# EasyEDA schematic SCH_555 Timer Based Keyboard_2023-12-17.json
TITLE: Sheet_1; REV: 1.0; Date: 2023-11-20; Sheet: 1/1; Drawn By: extras2765; Company: Your Company
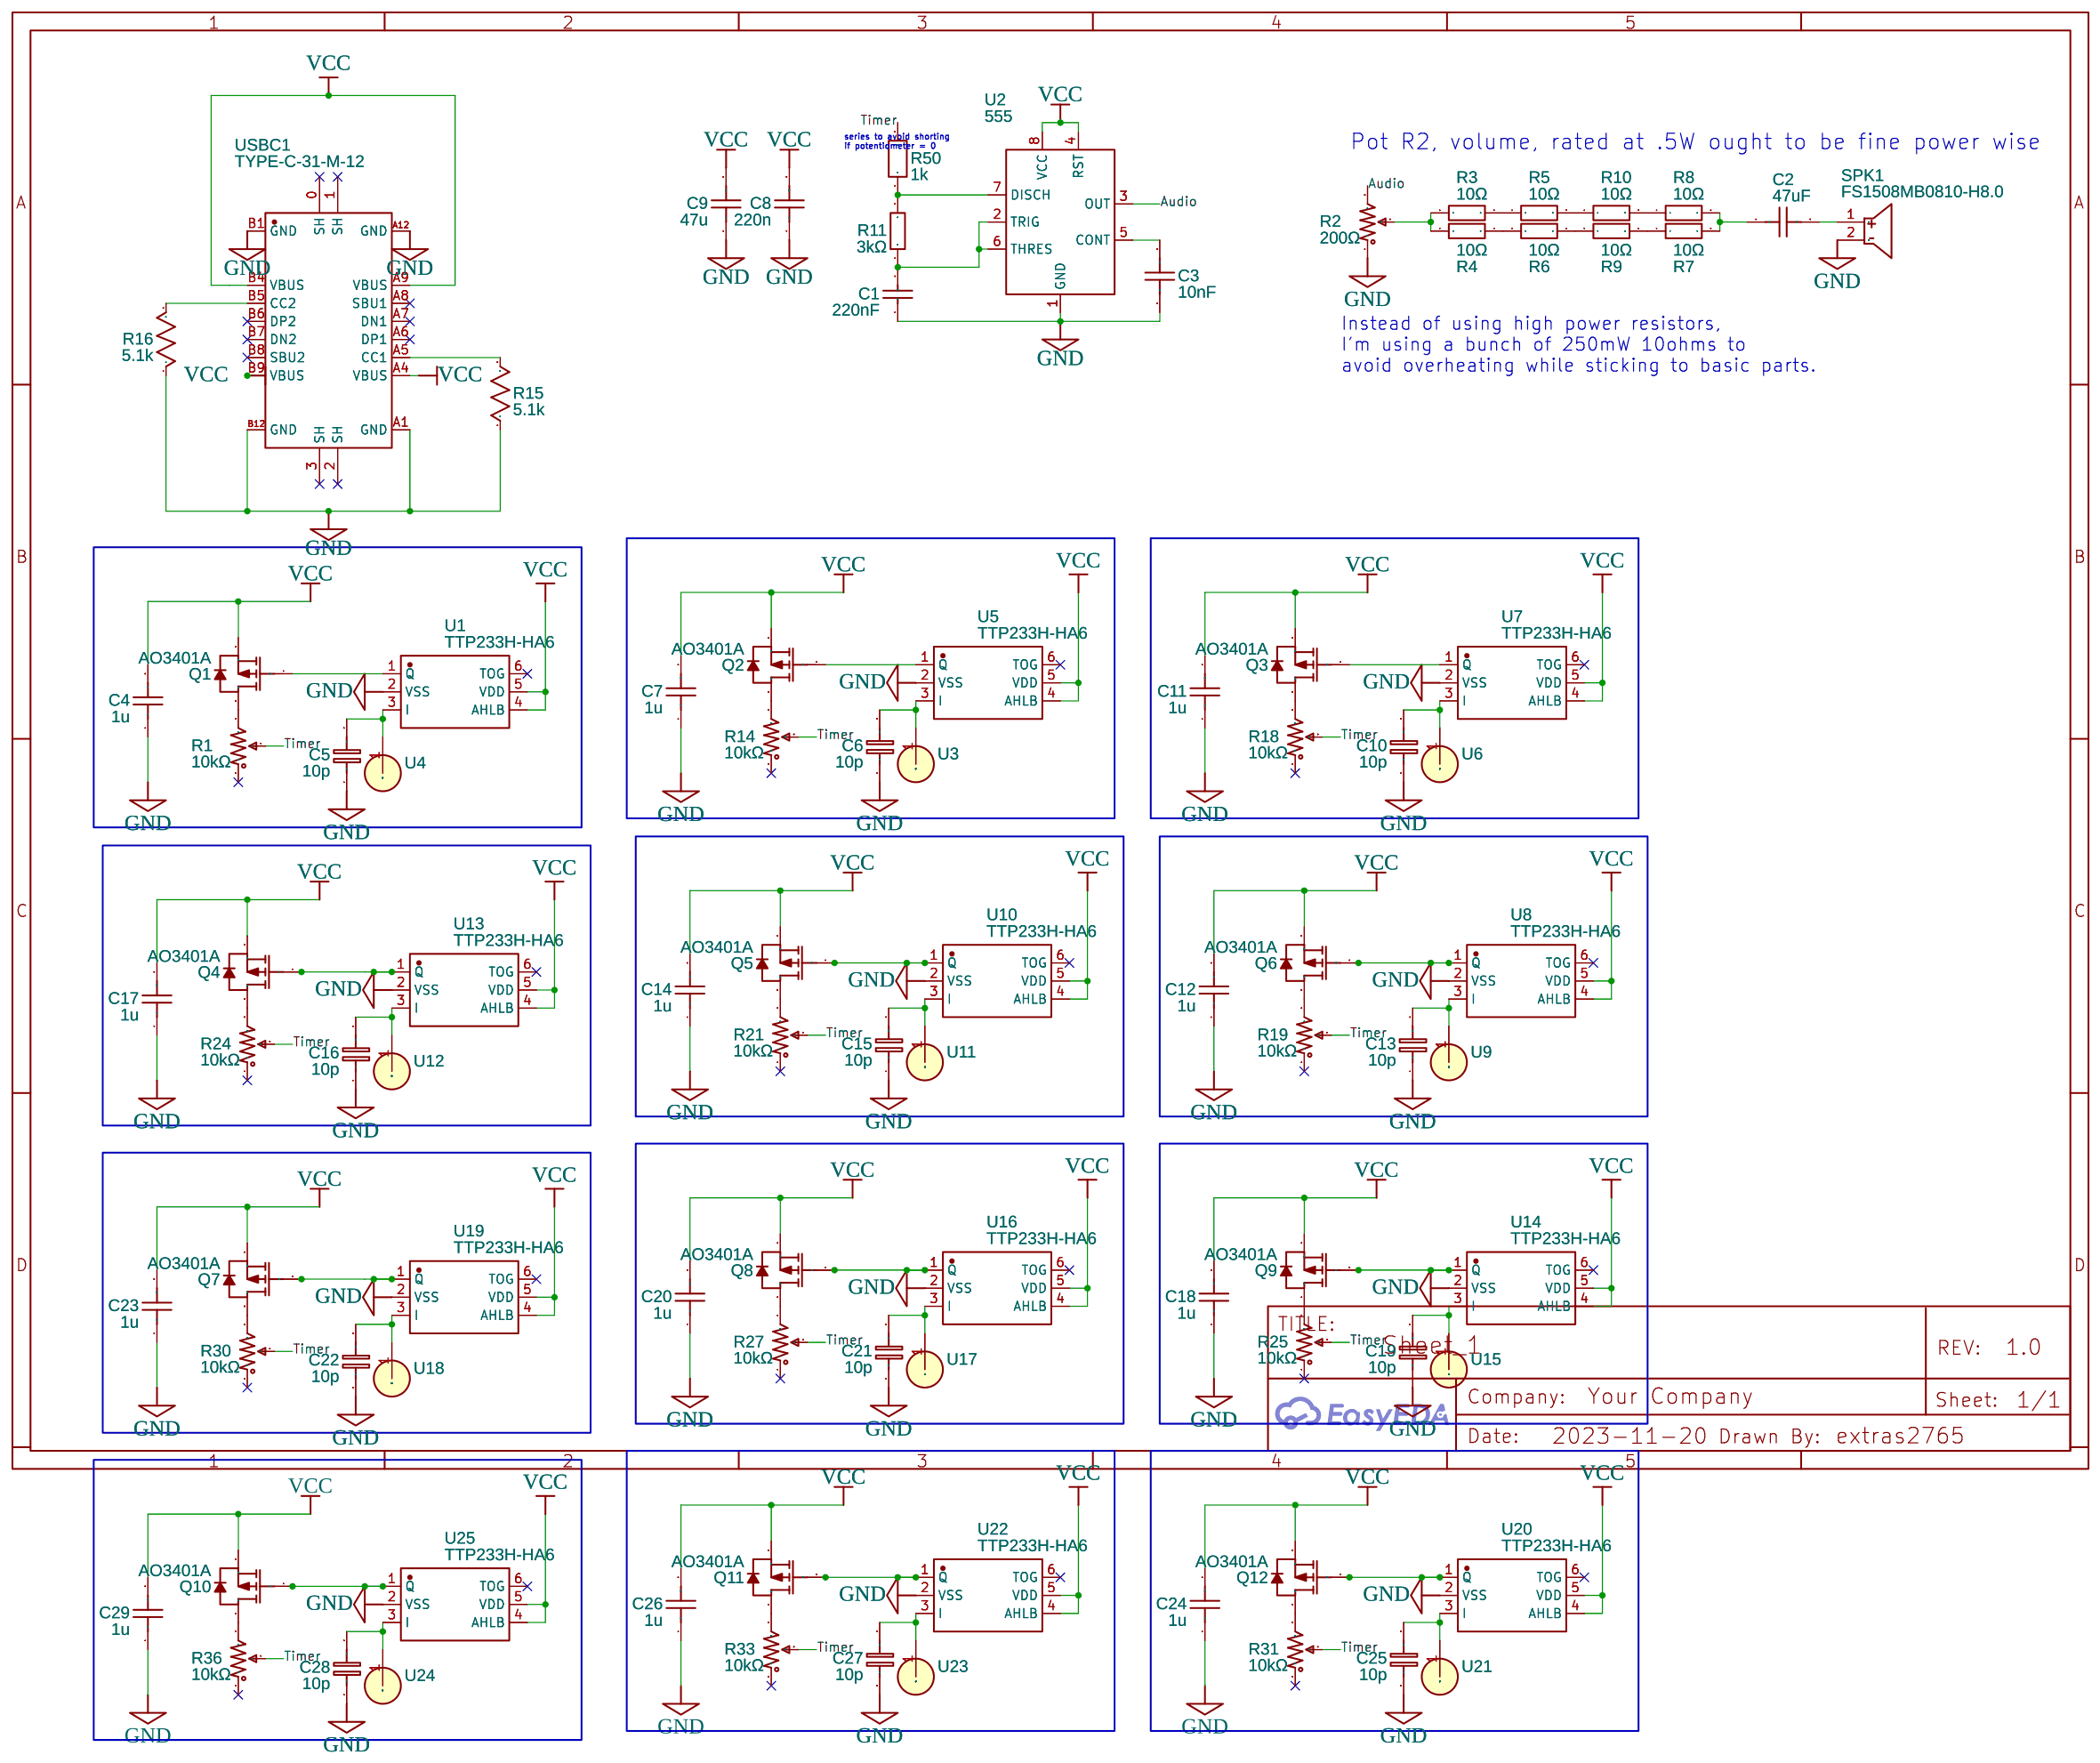
[diagram p0: schematic sheet]

## Parts
C1  220nF  [C0805]
C2  47uF  [C1206]
C3  10nF  [C0805]
C4  1u  [C0805]
C5  10p  [C0603]
C6  10p  [C0603]
C7  1u  [C0805]
C8  220n  [C0805]
C9  47u  [C0805]
C10  10p  [C0603]
C11  1u  [C0805]
C12  1u  [C0805]
C13  10p  [C0603]
C14  1u  [C0805]
C15  10p  [C0603]
C16  10p  [C0603]
C17  1u  [C0805]
C18  1u  [C0805]
C19  10p  [C0603]
C20  1u  [C0805]
C21  10p  [C0603]
C22  10p  [C0603]
C23  1u  [C0805]
C24  1u  [C0805]
C25  10p  [C0603]
C26  1u  [C0805]
C27  10p  [C0603]
C28  10p  [C0603]
C29  1u  [C0805]
Q1  AO3401A  [SOT-23_L2.9-W1.3-P1.90-LS2.4-BR]
Q2  AO3401A  [SOT-23_L2.9-W1.3-P1.90-LS2.4-BR]
Q3  AO3401A  [SOT-23_L2.9-W1.3-P1.90-LS2.4-BR]
Q4  AO3401A  [SOT-23_L2.9-W1.3-P1.90-LS2.4-BR]
Q5  AO3401A  [SOT-23_L2.9-W1.3-P1.90-LS2.4-BR]
Q6  AO3401A  [SOT-23_L2.9-W1.3-P1.90-LS2.4-BR]
Q7  AO3401A  [SOT-23_L2.9-W1.3-P1.90-LS2.4-BR]
Q8  AO3401A  [SOT-23_L2.9-W1.3-P1.90-LS2.4-BR]
Q9  AO3401A  [SOT-23_L2.9-W1.3-P1.90-LS2.4-BR]
Q10  AO3401A  [SOT-23_L2.9-W1.3-P1.90-LS2.4-BR]
Q11  AO3401A  [SOT-23_L2.9-W1.3-P1.90-LS2.4-BR]
Q12  AO3401A  [SOT-23_L2.9-W1.3-P1.90-LS2.4-BR]
R1  10kΩ  [RES-ADJ-TH_3P-L10.0-W10.0-P2.50-L]
R2  200Ω  [RES-ADJ-TH_3P-L9.5-W9.5-P2.54-BR-BS]
R3  10Ω  [R1206]
R4  10Ω  [R1206]
R5  10Ω  [R1206]
R6  10Ω  [R1206]
R7  10Ω  [R1206]
R8  10Ω  [R1206]
R9  10Ω  [R1206]
R10  10Ω  [R1206]
R11  3kΩ  [R0805]
R14  10kΩ  [RES-ADJ-TH_3P-L10.0-W10.0-P2.50-L]
R15  5.1k  [R0805]
R16  5.1k  [R0805]
R18  10kΩ  [RES-ADJ-TH_3P-L10.0-W10.0-P2.50-L]
R19  10kΩ  [RES-ADJ-TH_3P-L10.0-W10.0-P2.50-L]
R21  10kΩ  [RES-ADJ-TH_3P-L10.0-W10.0-P2.50-L]
R24  10kΩ  [RES-ADJ-TH_3P-L10.0-W10.0-P2.50-L]
R25  10kΩ  [RES-ADJ-TH_3P-L10.0-W10.0-P2.50-L]
R27  10kΩ  [RES-ADJ-TH_3P-L10.0-W10.0-P2.50-L]
R30  10kΩ  [RES-ADJ-TH_3P-L10.0-W10.0-P2.50-L]
R31  10kΩ  [RES-ADJ-TH_3P-L10.0-W10.0-P2.50-L]
R33  10kΩ  [RES-ADJ-TH_3P-L10.0-W10.0-P2.50-L]
R36  10kΩ  [RES-ADJ-TH_3P-L10.0-W10.0-P2.50-L]
R50  1k  [R0805]
SPK1  FS1508MB0810-H8.0  [BEEP-TH_BD15.0-P10.20-D1.2]
U1  TTP233H-HA6  [SOT-23-6_L2.9-W1.6-P0.95-LS2.8-BL]
U2  555  [SOIC-8_L4.9-W3.9-P1.27-LS6.0-BL]
U3  TouchPad  [TOUCHPAD]
U4  TouchPad  [TOUCHPAD]
U5  TTP233H-HA6  [SOT-23-6_L2.9-W1.6-P0.95-LS2.8-BL]
U6  TouchPad  [TOUCHPAD]
U7  TTP233H-HA6  [SOT-23-6_L2.9-W1.6-P0.95-LS2.8-BL]
U8  TTP233H-HA6  [SOT-23-6_L2.9-W1.6-P0.95-LS2.8-BL]
U9  TouchPad  [TOUCHPAD]
U10  TTP233H-HA6  [SOT-23-6_L2.9-W1.6-P0.95-LS2.8-BL]
U11  TouchPad  [TOUCHPAD]
U12  TouchPad  [TOUCHPAD]
U13  TTP233H-HA6  [SOT-23-6_L2.9-W1.6-P0.95-LS2.8-BL]
U14  TTP233H-HA6  [SOT-23-6_L2.9-W1.6-P0.95-LS2.8-BL]
U15  TouchPad  [TOUCHPAD]
U16  TTP233H-HA6  [SOT-23-6_L2.9-W1.6-P0.95-LS2.8-BL]
U17  TouchPad  [TOUCHPAD]
U18  TouchPad  [TOUCHPAD]
U19  TTP233H-HA6  [SOT-23-6_L2.9-W1.6-P0.95-LS2.8-BL]
U20  TTP233H-HA6  [SOT-23-6_L2.9-W1.6-P0.95-LS2.8-BL]
U21  TouchPad  [TOUCHPAD]
U22  TTP233H-HA6  [SOT-23-6_L2.9-W1.6-P0.95-LS2.8-BL]
U23  TouchPad  [TOUCHPAD]
U24  TouchPad  [TOUCHPAD]
U25  TTP233H-HA6  [SOT-23-6_L2.9-W1.6-P0.95-LS2.8-BL]
USBC1  TYPE-C-31-M-12  [USB-C_SMD-TYPE-C-31-M-12]

## Library data of the parts
C1 = CL21B224KBFNNNE: Supplier: LCSC; Manufacturer: SAMSUNG(三星); Supplier Part: C5378; JLCPCB Part Class: Basic Part; link: https://lcsc.com/eda_search?q=C5378&%26type=1&ref=editor
C2 = CL31A476MPHNNNE: Supplier: LCSC; Manufacturer: SAMSUNG(三星); Supplier Part: C96123; JLCPCB Part Class: Basic Part; link: https://lcsc.com/eda_search?q=C96123&%26type=1&ref=editor
C3 C4 C7-C9 C11 C12 C14 C17 C18 C20 C23 C24 C26 C29 = C_0805_US: Contributor: LCEDA_Lib
C5 C6 C10 C13 C15 C16 C19 C21 C22 C25 C27 C28 = C_0603_EU: Contributor: LCEDA_Lib
Q1-Q12 = AO3401A: Supplier: LCSC; Manufacturer: AOS; Supplier Part: C15127; JLCPCB Part Class: Basic Part; link: https://lcsc.com/eda_search?q=C15127&%26type=1&ref=editor
R1 R14 R18 R19 R21 R24 R25 R27 R30 R31 R33 R36 = 3296W-1-103: Resistance(Ohms): 10K; Contributor: LCSC; Supplier: LCSC; Supplier Part: C118954; Manufacturer: BOCHEN(博晨); JLCPCB Part Class: Extended Part; link: https://lcsc.com/eda_search?q=C118954&%26type=1&ref=editor
R2 = 3386P-1-201TLF: Resistance(Ohms): 200; Supplier: LCSC; Manufacturer: BOURNS; Supplier Part: C116307; JLCPCB Part Class: Extended Part; link: https://lcsc.com/eda_search?q=C116307&%26type=1&ref=editor
R3-R10 = 1206W4F100JT5E: Supplier: LCSC; Manufacturer: UNI-ROYAL(厚声); Supplier Part: C17903; JLCPCB Part Class: Basic Part; link: https://lcsc.com/eda_search?q=C17903&%26type=1&ref=editor
R11 = 0805W8F3001T5E: Supplier: LCSC; Manufacturer: UNI-ROYAL(厚声); Supplier Part: C17661; JLCPCB Part Class: Basic Part; link: https://lcsc.com/eda_search?q=C17661&%26type=1&ref=editor
R15 R16 = R_0805_US: Contributor: LCEDA_Lib
R50 = R_0805_EU: Contributor: LCEDA_Lib
SPK1 = FS1508MB0810-H8.0: Contributor: LCSC; Supplier: LCSC; Supplier Part: C969972; Manufacturer: FUET(福声科技); JLCPCB Part Class: Extended Part; link: https://lcsc.com/eda_search?q=C969972&%26type=1&ref=editor
U1 U5 U7 U8 U10 U13 U14 U16 U19 U20 U22 U25 = TTP233H-HA6: Contributor: LCSC; Supplier: LCSC; Supplier Part: C2835626; Manufacturer: TONTEK(通泰); JLCPCB Part Class: Extended Part; link: https://lcsc.com/eda_search?q=C2835626&%26type=1&ref=editor
U2 = NE555DR: Supplier: LCSC; Manufacturer: TI(德州仪器); Supplier Part: C7593; JLCPCB Part Class: Basic Part; link: https://lcsc.com/eda_search?q=C7593&%26type=1&ref=editor
U3 U4 U6 U9 U11 U12 U15 U17 U18 U21 U23 U24 = TouchPad: Contributor: kudsvituija
USBC1 = TYPE-C-31-M-12: Contributor: LCSC; Supplier: LCSC; Supplier Part: C165948; Manufacturer: 韩国韩荣; JLCPCB Part Class: Extended Part; link: https://lcsc.com/eda_search?q=C165948&%26type=1&ref=editor

## Nets
GND: C1.1 C3.1 C4.1 C5.1 C6.1 C7.1 C8.1 C9.1 C10.1 C11.1 C12.1 C13.1 C14.1 C15.1 C16.1 C17.1 C18.1 C19.1 C20.1 C21.1 C22.1 C23.1 C24.1 C25.1 C26.1 C27.1 C28.1 C29.1 R2.1 R15.1 R16.1 SPK1.2 U1.2(VSS) U2.1(GND) U5.2(VSS) U7.2(VSS) U8.2(VSS) U10.2(VSS) U13.2(VSS) U14.2(VSS) U16.2(VSS) U19.2(VSS) U20.2(VSS) U22.2(VSS) U25.2(VSS) USBC1.A1(GND) USBC1.A12(GND) USBC1.B1(GND) USBC1.B12(GND)
VCC: C4.2 C7.2 C8.2 C9.2 C11.2 C12.2 C14.2 C17.2 C18.2 C20.2 C23.2 C24.2 C26.2 C29.2 Q1.2(S) Q2.2(S) Q3.2(S) Q4.2(S) Q5.2(S) Q6.2(S) Q7.2(S) Q8.2(S) Q9.2(S) Q10.2(S) Q11.2(S) Q12.2(S) U1.4(AHLB) U1.5(VDD) U2.4(RST) U2.8(VCC) U5.4(AHLB) U5.5(VDD) U7.4(AHLB) U7.5(VDD) U8.4(AHLB) U8.5(VDD) U10.4(AHLB) U10.5(VDD) U13.4(AHLB) U13.5(VDD) U14.4(AHLB) U14.5(VDD) U16.4(AHLB) U16.5(VDD) U19.4(AHLB) U19.5(VDD) U20.4(AHLB) U20.5(VDD) U22.4(AHLB) U22.5(VDD) U25.4(AHLB) U25.5(VDD) USBC1.A4(VBUS) USBC1.A9(VBUS) USBC1.B4(VBUS) USBC1.B9(VBUS)
Audio: R2.3 U2.3(OUT)
Timer: R1.2 R14.2 R18.2 R19.2 R21.2 R24.2 R25.2 R27.2 R30.2 R31.2 R33.2 R36.2 R50.2
Net-(C1-2): C1.2 R11.1 U2.2(TRIG) U2.6(THRES)
Net-(C2-1): C2.1 R7.2 R8.2
Net-(C2-2): C2.2 SPK1.1
Net-(C3-2): C3.2 U2.5(CONT)
Net-(C5-2): C5.2 U1.3(I) U4.1(Touch)
Net-(C6-2): C6.2 U3.1(Touch) U5.3(I)
Net-(C10-2): C10.2 U6.1(Touch) U7.3(I)
Net-(C13-2): C13.2 U8.3(I) U9.1(Touch)
Net-(C15-2): C15.2 U10.3(I) U11.1(Touch)
Net-(C16-2): C16.2 U12.1(Touch) U13.3(I)
Net-(C19-2): C19.2 U14.3(I) U15.1(Touch)
Net-(C21-2): C21.2 U16.3(I) U17.1(Touch)
Net-(C22-2): C22.2 U18.1(Touch) U19.3(I)
Net-(C25-2): C25.2 U20.3(I) U21.1(Touch)
Net-(C27-2): C27.2 U22.3(I) U23.1(Touch)
Net-(C28-2): C28.2 U24.1(Touch) U25.3(I)
Net-(Q1-1): Q1.1(G) U1.1(Q)
Net-(Q1-3): Q1.3(D) R1.3
Net-(Q2-1): Q2.1(G) U5.1(Q)
Net-(Q2-3): Q2.3(D) R14.3
Net-(Q3-1): Q3.1(G) U7.1(Q)
Net-(Q3-3): Q3.3(D) R18.3
Net-(Q4-1): Q4.1(G) U13.1(Q)
Net-(Q4-3): Q4.3(D) R24.3
Net-(Q5-1): Q5.1(G) U10.1(Q)
Net-(Q5-3): Q5.3(D) R21.3
Net-(Q6-1): Q6.1(G) U8.1(Q)
Net-(Q6-3): Q6.3(D) R19.3
Net-(Q7-1): Q7.1(G) U19.1(Q)
Net-(Q7-3): Q7.3(D) R30.3
Net-(Q8-1): Q8.1(G) U16.1(Q)
Net-(Q8-3): Q8.3(D) R27.3
Net-(Q9-1): Q9.1(G) U14.1(Q)
Net-(Q9-3): Q9.3(D) R25.3
Net-(Q10-1): Q10.1(G) U25.1(Q)
Net-(Q10-3): Q10.3(D) R36.3
Net-(Q11-1): Q11.1(G) U22.1(Q)
Net-(Q11-3): Q11.3(D) R33.3
Net-(Q12-1): Q12.1(G) U20.1(Q)
Net-(Q12-3): Q12.3(D) R31.3
Net-(R2-2): R2.2 R3.1 R4.1
Net-(R3-2): R3.2 R5.1
Net-(R4-2): R4.2 R6.1
Net-(R5-2): R5.2 R10.1
Net-(R6-2): R6.2 R9.1
Net-(R7-1): R7.1 R9.2
Net-(R8-1): R8.1 R10.2
Net-(R11-2): R11.2 R50.1 U2.7(DISCH)
Net-(R15-2): R15.2 USBC1.A5(CC1)
Net-(R16-2): R16.2 USBC1.B5(CC2)

Not connected (* = marked no-connect by the designer): R1 1*; R14 1*; R18 1*; R19 1*; R21 1*; R24 1*; R25 1*; R27 1*; R30 1*; R31 1*; R33 1*; R36 1*; U1 6(TOG)*; U5 6(TOG)*; U7 6(TOG)*; U8 6(TOG)*; U10 6(TOG)*; U13 6(TOG)*; U14 6(TOG)*; U16 6(TOG)*; U19 6(TOG)*; U20 6(TOG)*; U22 6(TOG)*; U25 6(TOG)*; USBC1 0(SH)* 1(SH)* 2(SH)* 3(SH)* A6(DP1)* A7(DN1)* A8(SBU1)* B6(DP2)* B7(DN2)* B8(SBU2)*

## Notes on the sheet
- series to avoid shorting
  if potentiometer = 0
- Pot R2, volume, rated at .5W ought to be fine power wise
- Instead of using high power resistors,
  I'm using a bunch of 250mW 10ohms to
  avoid overheating while sticking to basic parts.
